# EAGLE design untitled (EAGLE 9.6.2)
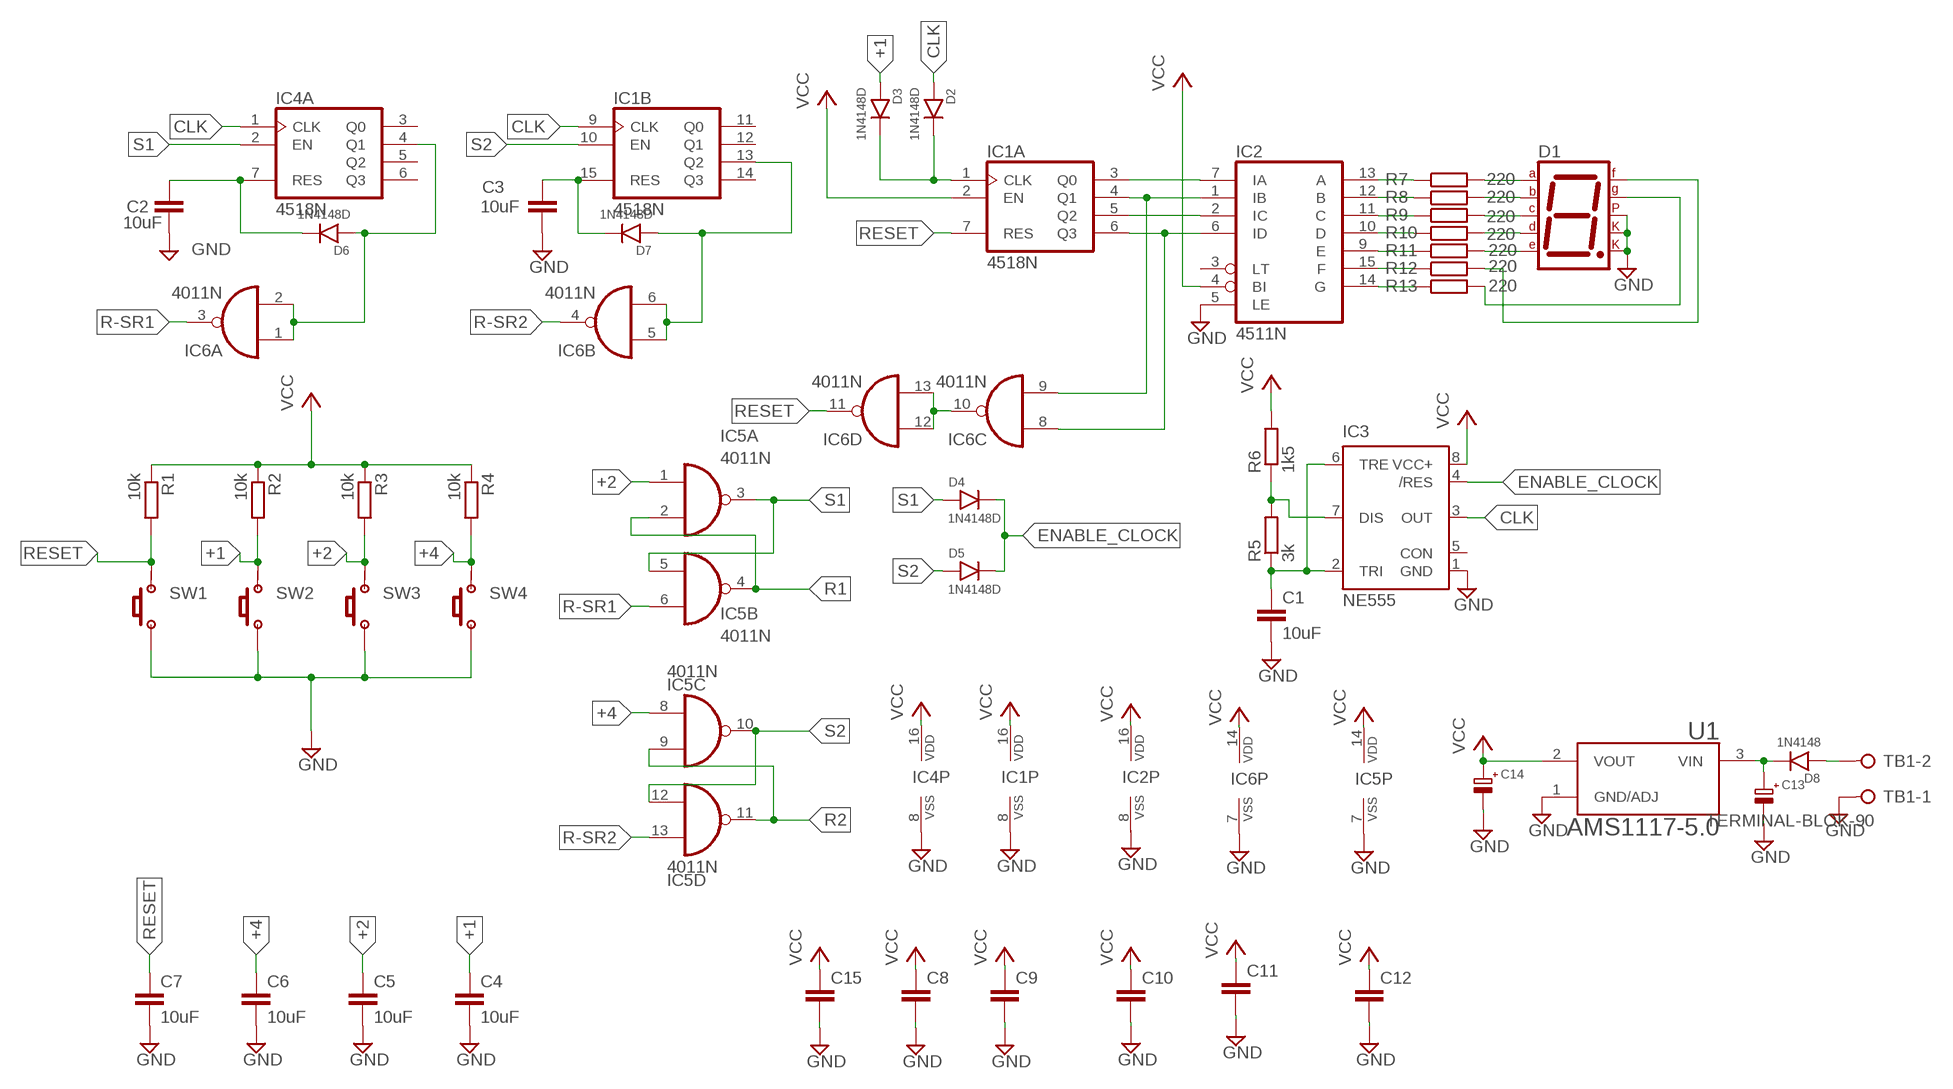
[diagram p0: schematic, sheet 1]

## Parts
C1  10uF  CAP-NON0805  [SMD0805]
C2  10uF  CAP-NON0805  [SMD0805]
C3  10uF  CAP-NON0805  [SMD0805]
C4  10uF  CAP-NON0805  [SMD0805]
C5  10uF  CAP-NON0805  [SMD0805]
C6  10uF  CAP-NON0805  [SMD0805]
C7  10uF  CAP-NON0805  [SMD0805]
C8  CAP-NON  [MKM]
C9  CAP-NON  [MKM]
C10  CAP-NON  [MKM]
C11  CAP-NON  [MKM]
C12  CAP-NON  [MKM]
C13  CAP-ELCO  [ELCO1]
C14  CAP-ELCO  [ELCO1]
C15  CAP-NON  [MKM]
D1  7SEG-CK  [7SEG-13]
D2  1N4148D  [SOD80C]
D3  1N4148D  [SOD80C]
D4  1N4148D  [SOD80C]
D5  1N4148D  [SOD80C]
D6  1N4148D  [SOD80C]
D7  1N4148D  [SOD80C]
D8  1N4148  [DIODE]
IC1  4518N  [DIL16]
IC2  4511N  [DIL16]
IC3  NE555  [DIL-08]
IC4  4518N  [DIL16]
IC5  4011N  [DIL14]
IC6  4011N  [DIL14]
R1  10k  RES0805  [SMD0805]
R2  10k  RES0805  [SMD0805]
R3  10k  RES0805  [SMD0805]
R4  10k  RES0805  [SMD0805]
R5  3k  RES0805  [SMD0805]
R6  1k5  RES0805  [SMD0805]
R7  220  RES0805  [SMD0805]
R8  220  RES0805  [SMD0805]
R9  220  RES0805  [SMD0805]
R10  220  RES0805  [SMD0805]
R11  220  RES0805  [SMD0805]
R12  220  RES0805  [SMD0805]
R13  220  RES0805  [SMD0805]
SW1  PUSH_BUTTON4P  [PUSH_BUTTON_4P]
SW2  PUSH_BUTTON4P  [PUSH_BUTTON_4P]
SW3  PUSH_BUTTON4P  [PUSH_BUTTON_4P]
SW4  PUSH_BUTTON4P  [PUSH_BUTTON_4P]
TB1  TERMINAL-BLOK-90  [MSTBA2]
U1  AMS1117-5.0  [SOT229P700X180-4N]

## Nets
+1: C4.1 D3.A R2.2 SW2.3 SW2.4
+2: C5.1 IC5.1(A:I0) R3.2 SW3.3 SW3.4
+4: C6.1 IC5.8(C:I0) R4.2 SW4.3 SW4.4
CLK: D2.A IC1.9(B:CLK) IC3.3(OUT) IC4.1(A:CLK)
ENABLE_CLOCK: D4.C D5.C IC3.4(/RES)
GND: C1.2 C2.2 C3.2 C4.2 C5.2 C6.2 C7.2 C8.2 C9.2 C10.2 C11.2 C12.2 C13.2 C14.2 C15.2 D1.3(CK1) D1.5(DP) D1.8(CK2) IC1.8(P:VSS) IC2.5(LE) IC3.1(GND) IC4.8(P:VSS) IC5.7(P:VSS) IC6.7(P:VSS) SW1.1 SW1.2 SW2.1 SW2.2 SW3.1 SW3.2 SW4.1 SW4.2 TB1.1 U1.1(GND/ADJ)
N$1: IC2.13(A) R7.1
N$2: D1.1(E) R11.2
N$3: D1.2(D) R10.2
N$4: D1.4(C) R9.2
N$5: D1.6(B) R8.2
N$6: D1.9(F) R12.2
N$7: D1.10(G) R13.2
N$8: IC1.6(A:Q3) IC2.6(ID) IC6.8(C:I0)
N$9: IC1.5(A:Q2) IC2.2(IC)
N$10: IC1.4(A:Q1) IC2.1(IB) IC6.9(C:I1)
N$11: IC1.3(A:Q0) IC2.7(IA)
N$12: C1.1 IC3.2(TRI) IC3.6(TRE) R5.1
N$13: D2.C D3.C IC1.1(A:CLK)
N$14: IC3.7(DIS) R5.2 R6.1
N$15: C2.1 D6.C IC4.7(A:RES)
N$16: C3.1 D7.C IC1.15(B:RES)
N$17: D6.A IC4.4(A:Q1) IC6.1(A:I0) IC6.2(A:I1)
N$18: D7.A IC1.13(B:Q2) IC6.5(B:I0) IC6.6(B:I1)
N$19: IC6.10(C:O) IC6.12(D:I0) IC6.13(D:I1)
N$20: D1.7(A) R7.2
N$21: IC2.12(B) R8.1
N$22: IC2.11(C) R9.1
N$23: IC2.10(D) R10.1
N$24: IC2.9(E) R11.1
N$25: IC2.15(F) R12.1
N$26: IC2.14(G) R13.1
N$32: C13.1 D8.2 U1.3(VIN)
N$33: D8.1 TB1.2
R1: IC5.2(A:I1) IC5.4(B:O)
R2: IC5.9(C:I1) IC5.11(D:O)
R-SR1: IC5.6(B:I1) IC6.3(A:O)
R-SR2: IC5.13(D:I1) IC6.4(B:O)
RESET: C7.1 IC1.7(A:RES) IC6.11(D:O) R1.2 SW1.3 SW1.4
S1: D4.A IC4.2(A:EN) IC5.3(A:O) IC5.5(B:I0)
S2: D5.A IC1.10(B:EN) IC5.10(C:O) IC5.12(D:I0)
VCC: C8.1 C9.1 C10.1 C11.1 C12.1 C14.1 C15.1 IC1.2(A:EN) IC1.16(P:VDD) IC2.4(BI) IC2.16(VDD) IC3.8(VCC+) IC4.16(P:VDD) IC5.14(P:VDD) IC6.14(P:VDD) R1.1 R2.1 R3.1 R4.1 R6.2 U1.2(VOUT)
Unconnected: IC1.11(B:Q0) IC1.12(B:Q1) IC1.14(B:Q3) IC2.3(LT) IC3.5(CON) IC4.3(A:Q0) IC4.5(A:Q2) IC4.6(A:Q3) IC4.9(B:CLK) IC4.10(B:EN) IC4.11(B:Q0) IC4.12(B:Q1) IC4.13(B:Q2) IC4.14(B:Q3) IC4.15(B:RES)

## Power pins joined to a net without a drawn wire
VSS: IC2.8(VSS)

## Library data of the parts
C1-C12 C15 = LKS_NAS_2024_PHD_A2_Library:CAP-NON
C13 C14 = LKS_NAS_2024_PHD_A2_Library:CAP-ELCO
D1 = special:7SEG-CK: 7-segment DISPLAY single cathode, 13 mm
D2-D8 = LKS_NAS_2024_PHD_A2_Library:1N4148
IC1 IC4 = 45xx:4518: Dual BCD up COUNTER
IC2 = 45xx:4511: BCD to 7-segment LATCH/DECODER/DRIVER
IC3 = st-microelectronics:NE555: General purpose bipolar Timer; MF: Arrow Electronics; MPN: NE555N; OC_FARNELL: 1467742; OC_NEWARK: 89K1486
IC5 IC6 = 40xx:4011: Quad 2-input NAND
R1-R13 = LKS_NAS_2024_PHD_A2_Library:RES: RESISTOR, European symbol
SW1-SW4 = LKS_NAS_2024_PHD_A2_Library:PUSH_BUTTON
TB1 = LKS_NAS_2024_PHD_A2_Library:TERMINAL-BLOK
U1 = 00-2024-SelekdaWSA:AMS1117-5.0: Check availability <https://pricing.snapeda.com/parts/AMS1117-5.0/Advanced%20Monolithic%20Systems/view-part?ref=eda>

## Board
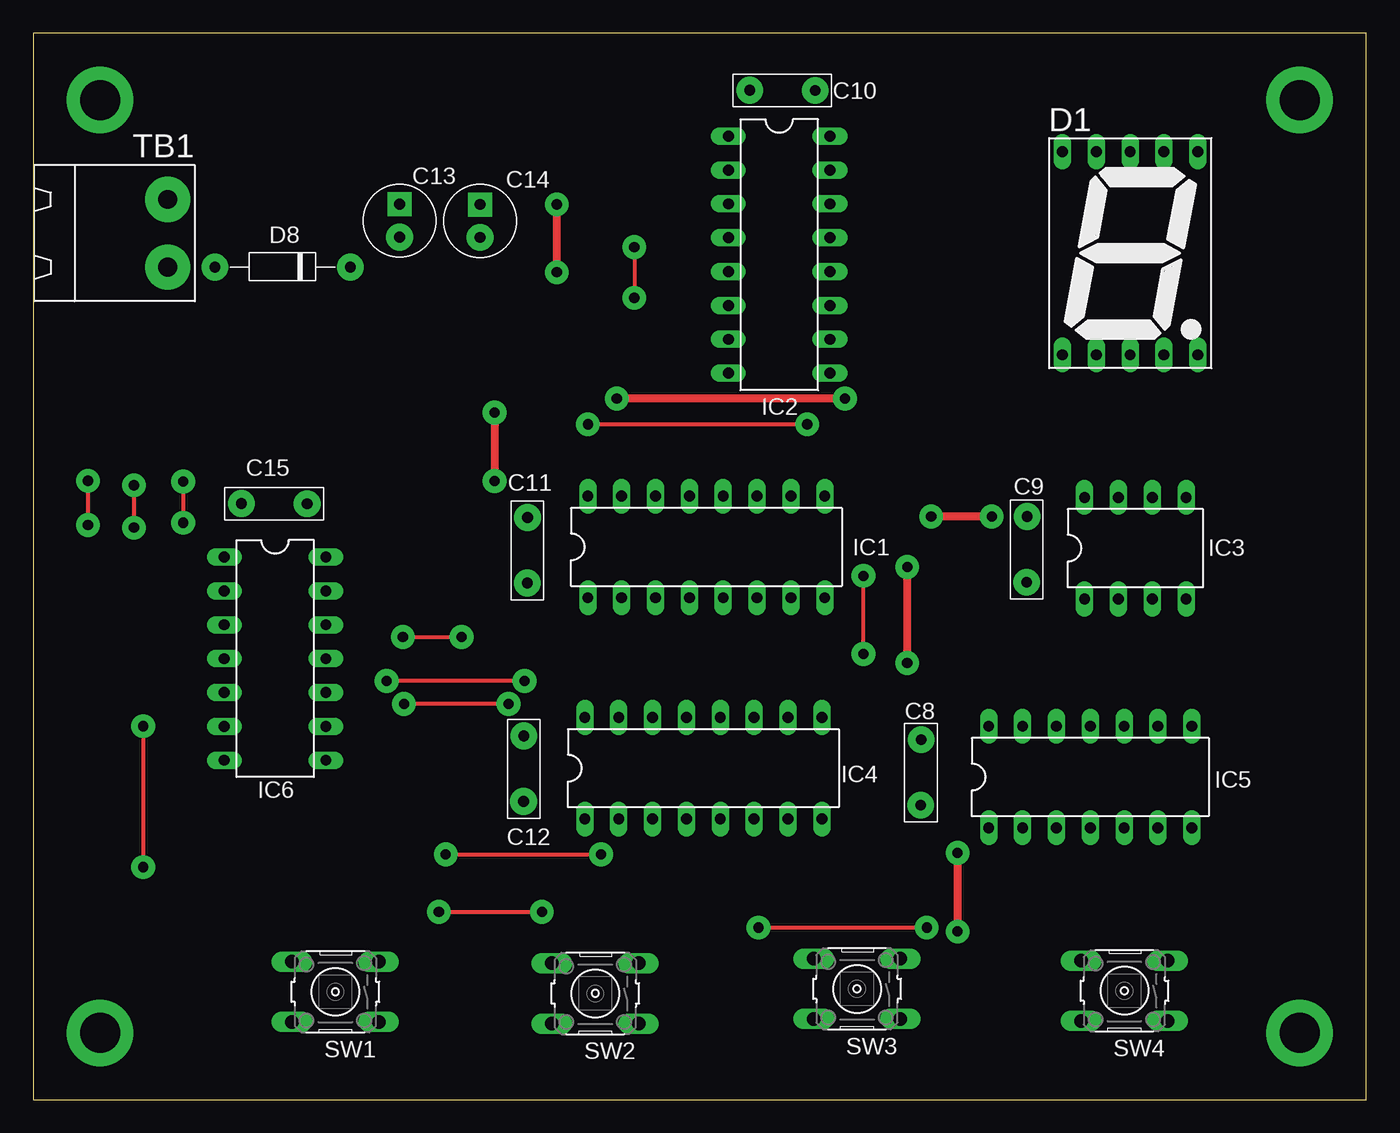
[diagram p1: board, top side]
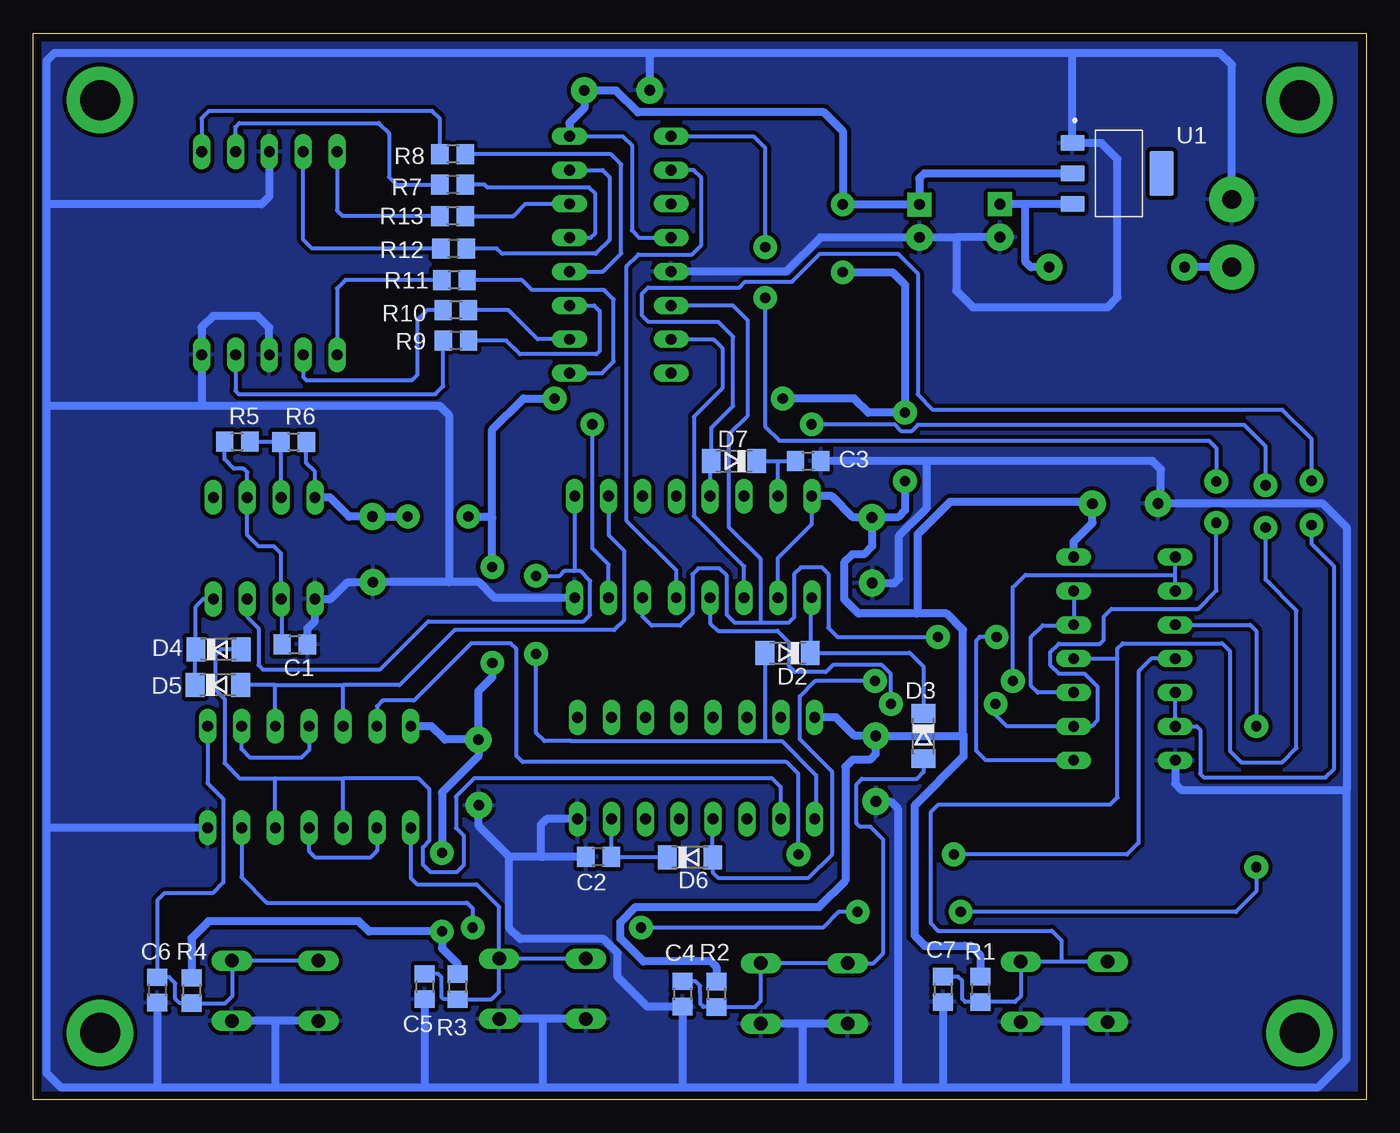
[diagram p2: board, bottom side, seen from below]

Size 100 x 80 mm. Coordinates in mm from the lower left corner, seen from the top.
Outline: 0,0 100,0 100,80 0,80 0,0
Copper layers (1*16): Top 0.035mm / dielectric 1.5mm / Bottom 0.035mm
Design rules "default": minimum track width 12mil, minimum drill 30mil, track to track 12mil, track to pad 12mil, pad to pad 12mil, via to via 6mil, smd to smd 6mil, copper to edge 24mil, drill to drill 6mil, minimum pad ring 10mil, minimum via ring 8mil, stop-mask expansion 4mil, vias tented up to drill 0mil, thermal gap 12mil

### Footprints (pad centres in the part's own frame; a part is rotated, then mirrored left to right if it is on the bottom)
SMD0805 = smd 1.3 x 1.5: 1 -0.95,0; 2 0.95,0
MKM = drill 0.8 pad 2: 1 -2.282,-0.019; 2 2.637,-0.047
ELCO1 = drill 0.8 pad 1.8 square: 1 -1.24,0 | drill 0.8 pad 2: 2 1.24,0
7SEG-13 = drill 0.813 long: 1 -5.08,-7.62; 2 -2.54,-7.62; 3 0,-7.62; 4 2.54,-7.62; 5 5.08,-7.62; 6 5.08,7.62; 7 2.54,7.62; 8 0,7.62; 9 -2.54,7.62; 10 -5.08,7.62
SOD80C = smd 1.4 x 1.8: A 1.7,0; C -1.7,0
DIODE = drill 0.8 pad 2: 1 -5.064,0.004; 2 5.096,0.004
DIL16 = drill 0.813 long: 1 -8.89,-3.81; 2 -6.35,-3.81; 3 -3.81,-3.81; 4 -1.27,-3.81; 5 1.27,-3.81; 6 3.81,-3.81; 7 6.35,-3.81; 8 8.89,-3.81; 9 8.89,3.81; 10 6.35,3.81; 11 3.81,3.81; 12 1.27,3.81; 13 -1.27,3.81; 14 -3.81,3.81; 15 -6.35,3.81; 16 -8.89,3.81
DIL-08 = drill 0.813 long: 1 -3.81,-3.81; 2 -1.27,-3.81; 3 1.27,-3.81; 4 3.81,-3.81; 5 3.81,3.81; 6 1.27,3.81; 7 -1.27,3.81; 8 -3.81,3.81
DIL14 = drill 0.813 long: 1 -7.62,-3.81; 2 -5.08,-3.81; 3 -2.54,-3.81; 4 0,-3.81; 5 2.54,-3.81; 6 5.08,-3.81; 7 7.62,-3.81; 8 7.62,3.81; 9 5.08,3.81; 10 2.54,3.81; 11 0,3.81; 12 -2.54,3.81; 13 -5.08,3.81; 14 -7.62,3.81
PUSH_BUTTON_4P = drill 1.016 long: 1 -3.251,2.261; 2 3.251,2.261; 3 -3.251,-2.261; 4 3.251,-2.261
MSTBA2 = drill 1.4 pad 3.4: 1 -2.54,5.08; 2 2.54,5.08
SOT229P700X180-4N = smd 1.2 x 1.8: 1 -2.29,-3.472; 2 0,-3.472; 3 2.29,-3.472 | smd 3.4 x 1.8: 4 0,3.218

### Placement (x,y rotation side)
C1  80.38,34.15 0 bottom
C2  57.6,18.2 180 bottom
C3  41.87,47.92 0 bottom
C4  51.3,7.92 270 bottom
C5  70.63,8.48 270 bottom
C6  90.7,8.22 270 bottom
C7  31.76,8.27 270 bottom
C8  66.63,24.72 270 top
C9  74.57,41.46 270 top
C10  56.38,75.69 180 top
C11  37.1,41.39 270 top
C12  36.83,25 270 top
C13  27.48,65.94 270 top
C14  33.52,65.92 270 top
C15  18.26,44.67 180 top
D1  82.29,63.5 0 top
D2  43.41,33.52 180 bottom
D3  33.21,27.27 270 bottom
D4  86.11,33.78 0 bottom
D5  86.15,31.09 0 bottom
D6  50.73,18.18 0 bottom
D7  47.44,47.89 180 bottom
D8  18.68,62.45 0 top
IC1  50.49,41.46 0 top
IC2  55.96,63.39 270 top
IC3  82.68,41.37 0 top
IC4  50.27,24.86 0 top
IC5  79.3,24.2 0 top
IC6  18.14,33.08 270 top
R1  28.95,8.27 270 bottom
R2  48.76,7.9 270 bottom
R3  68.17,8.47 270 bottom
R4  88.13,8.18 270 bottom
R5  84.7,49.37 0 bottom
R6  80.47,49.35 0 bottom
R7  68.54,68.65 180 bottom
R8  68.54,70.93 180 bottom
R9  68.3,56.95 180 bottom
R10  68.31,59.23 180 bottom
R11  68.41,61.49 180 bottom
R12  68.47,63.86 180 bottom
R13  68.54,66.29 180 bottom
SW1  22.66,8.08 180 top
SW2  42.16,7.96 180 top
SW3  61.8,8.3 180 top
SW4  81.86,8.16 180 top
TB1  5,65 270 top
U1  18.56,69.48 270 bottom

### Tracks (layer width: path | path; a pad name or v marks a point on that pad's centre or on a via)
+1
  Bottom 0.305: C4.1 50.32,8.87 49.97,8.52 49.97,8.01 49.96,8 49.96,7.19 49.72,6.95 R2.2 45.85,6.95 45.41,7.39 SW2.3 SW2.4 36.97,10.22 36.22,10.97 36.22,19.5 37.18,20.46 37.98,20.46 38.24,20.72 38.24,23.66 37.84,24.06 33.72,24.06 33.21,24.57 D3.A
+2
  Bottom 0.305: C5.1 69.65,9.43 69.38,9.16 69.38,7.69 69.2,7.52 R3.2 65.63,7.52 65.05,8.1 SW3.3 | SW3.4 SW3.3 | IC5.1 71.68,16.62 71.22,16.16 66.76,16.16 65.05,14.45 SW3.3
+4
  Bottom 0.305: IC5.8 86.92,23.72 85.75,22.55 85.75,16.29 86.56,15.48 90.17,15.48 90.7,14.95 C6.1 89.8,9.17 89.34,8.71 89.34,7.56 89.01,7.23 R4.2 85.62,7.23 85.06,7.79 85.06,10.42 | SW4.4 85.06,10.42 | 85.06,10.42 SW4.3
CLK  (via drill 0.76 pad 1.78)
  Top 0.305: v62.28,33.43 v62.28,39.29
  Bottom 0.305: IC3.3 83.95,36.21 83.1,35.36 83.1,32.59 82.79,32.28 73.97,32.28 70.38,35.87 58.72,35.87 58.22,36.38 58.22,38.91 58.94,39.64 59.4,39.64 | v62.28,33.43 62.28,27.52 61.66,26.9 59.63,26.9 59.62,26.89 45.11,26.89 | IC4.1 41.26,21.17 41.26,24.33 43.82,26.89 45.11,26.89 | v62.28,39.29 62.24,39.25 60.57,39.25 60.18,39.64 59.4,39.64 | 59.4,39.64 59.38,39.66 IC1.9 | 45.11,26.89 D2.A
ENABLE_CLOCK
  Bottom 0.305: D5.C 87.85,33.74 D4.C 87.81,37 87.25,37.56 IC3.4
GND
  Bottom 0.61: TB1.1 10.08,77.63 10.97,78.52 22,78.52 | 22,78.52 53.5,78.52 | 53.5,78.52 98.42,78.52 99.02,77.92 99.02,67.28 | 99.02,67.28 99.02,52.05 | 99.02,52.05 99.02,20.4 | 99.02,20.4 99.02,1.99 97.96,0.93 90.8,0.93 | 90.8,0.93 81.87,0.93 | 81.87,0.93 70.45,0.93 | 70.45,0.93 61.75,0.93 | 61.75,0.93 51.36,0.93 | 51.36,0.93 42.12,0.93 | 42.12,0.93 35.14,0.93 | 35.14,0.93 31.7,0.93 | 31.7,0.93 22.57,0.93 | 22.57,0.93 3.6,0.93 1.46,3.07 1.46,23.25 | 15.39,44.72 3.25,44.72 1.46,42.93 1.46,23.25 | 15.39,44.72 C15.2 | IC6.7 14.33,23.69 13.89,23.25 1.46,23.25 | SW1.2 22.53,5.82 | 22.53,5.82 SW1.1 | 22.53,5.82 22.53,0.97 22.57,0.93 | C7.2 31.76,0.99 31.7,0.93 | SW2.2 42.3,5.7 | 42.3,5.7 SW2.1 | 42.3,5.7 42.3,1.11 42.12,0.93 | 51.36,0.93 51.3,0.99 C4.2 53.93,6.97 56.16,9.2 56.16,10.99 57.21,12.04 63.47,12.04 64.29,12.86 64.29,18.2 | SW3.2 61.78,6.04 | 61.78,6.04 SW3.1 | 61.78,6.04 61.78,0.96 61.75,0.93 | SW4.2 81.85,5.9 | 81.85,5.9 SW4.1 | 81.85,5.9 81.87,5.88 81.87,0.93 | C5.2 70.63,1.11 70.45,0.93 | C6.2 90.7,1.03 90.8,0.93 | IC5.7 99.02,20.4 | 87.37,52.05 99.02,52.05 | 87.37,52.05 D1.5 87.37,57.94 86.52,58.79 83.16,58.79 82.29,57.92 D1.3 | C10.2 53.74,78.28 53.5,78.52 | 99.02,67.28 98.92,67.18 82.87,67.18 82.29,67.76 D1.8 | 87.37,52.05 69.5,52.05 68.82,51.37 68.82,38.82 | 35.14,0.93 35.14,21.84 35.66,22.36 C12.2 | 15.39,44.72 15.39,47.28 16.03,47.92 32.96,47.92 | C8.2 66.58,20.55 64.29,18.26 64.29,18.2 | IC4.8 61.49,21.05 61.93,20.61 61.93,18.31 61.82,18.2 | C2.2 61.82,18.2 | C13.2 30.75,64.7 | 30.75,64.7 33.5,64.7 C14.2 40.96,64.68 43.52,62.12 IC2.5 | 30.75,64.7 30.75,60.69 29.51,59.45 19.4,59.45 18.66,60.19 18.66,70.57 19.86,71.77 U1.1 22.03,78.49 22,78.52
  Bottom 0.61: 32.96,47.92 C3.2 | C1.2 79.43,35.35 78.87,35.91 IC3.1 77.68,37.56 76.42,38.82 C9.2 68.82,38.82 | IC1.8 65.4,37.65 66.57,38.82 68.82,38.82 | 61.82,18.2 64.29,18.2 | C11.2 35.39,38.75 35.05,39.09 35.05,42.31 32.96,44.4 32.96,47.92
  pour Bottom: 0,80 100,80 100,0 0,0
N$1
  Bottom 0.305: IC2.13 58.19,64.66 57.83,65.02 57.83,67.96 58.29,68.42 65.92,68.42 66.15,68.65 R7.1
N$2
  Bottom 0.305: R11.2 76.57,61.49 77.21,60.85 D1.1
N$3
  Bottom 0.305: R10.2 70.46,59.23 71.2,58.49 71.2,54.37 71.62,53.95 79.5,53.95 79.75,54.2 D1.2
N$4
  Bottom 0.305: D1.4 84.83,53.17 84.59,52.93 69.84,52.93 69.25,53.52 R9.2
N$5
  Bottom 0.305: R8.2 69.49,73.58 70.07,74.16 86.83,74.16 87.37,73.62 D1.6
N$6
  Bottom 0.305: R12.2 79.1,63.86 79.75,64.51 D1.9
N$7
  Bottom 0.305: D1.10 77.21,66.71 76.79,66.29 R13.2
N$8  (via drill 0.76 pad 1.78)
  Top 0.305: v27.73,34.71 v32.13,34.71
  Bottom 0.305: IC1.6 54.3,36.25 53.61,35.56 51.47,35.56 50.56,36.47 50.56,39.4 50.1,39.86 48.52,39.86 47.97,39.31 47.97,36.37 47.37,35.77 45.5,35.77 | IC2.6 47.52,59.58 46.4,58.46 46.4,51.32 47.8,49.92 47.8,42.92 45.46,40.58 45.46,35.81 45.5,35.77 | IC6.8 28.55,25.46 29.28,26.19 29.28,34.42 28.99,34.71 v27.73,34.71 | 45.5,35.77 43.34,35.77 42.92,36.18 42.92,39.43 42.42,39.93 40.84,39.93 40.35,39.44 40.35,35.39 39.67,34.71 v32.13,34.71
N$9
  Bottom 0.305: IC1.5 51.76,39.7 55.48,43.42 55.48,62.53 54.6,63.41 50.59,63.41 49.89,64.11 49.89,69.16 50.47,69.74 IC2.2
N$10  (via drill 0.76 pad 1.78)
  Top 0.305: v45.09,63.96 v45.09,60.15 | v11.24,46.37 v11.24,43.28 | v35.66,29.68 v27.81,29.68
  Bottom 0.305: IC2.1 45.97,72.28 45.09,71.4 v45.09,63.96 | v45.09,60.15 45.09,50.51 44.02,49.44 11.8,49.44 11.24,48.88 v11.24,46.37 | IC1.4 49.22,35.73 48.65,35.16 44.17,35.16 43.32,34.31 43.32,32.54 42.86,32.08 40.54,32.08 40.02,32.6 36.34,32.6 35.66,31.92 v35.66,29.68 | v27.81,29.68 27.81,28.84 26.97,28 IC6.9 20.6,28 20.17,28.43 20.17,31 21.13,31.96 23.07,31.96 23.73,32.62 23.73,33.54 23.07,34.2 19.98,34.2 19.69,34.49 19.69,36.24 19.11,36.82 12.6,36.82 11.24,38.18 v11.24,43.28
N$11
  Bottom 0.305: IC2.7 48.97,57.04 48.31,56.38 48.31,53.37 50.45,51.23 50.45,43.77 46.68,40 IC1.3
N$12
  Bottom 0.305: R5.1 85.65,48.04 84.95,47.34 84.22,47.34 83.95,47.07 IC3.6 83.95,42.34 83.11,41.5 81.94,41.5 81.41,40.97 IC3.2 81.33,37.48 C1.1
N$13
  Bottom 0.305: IC1.1 41.71,37.54 D2.C 34.25,33.52 33.21,32.48 D3.C
N$14
  Bottom 0.305: R5.2 83.73,49.35 R6.1 IC3.7
N$15
  Bottom 0.305: D6.C 56.63,18.18 C2.1 56.62,18.23 IC4.7
N$16
  Bottom 0.305: D7.C 44.14,47.89 | IC1.15 44.14,47.89 | 44.14,47.89 42.85,47.89 C3.1
N$17  (via drill 0.76 pad 1.78)
  Top 0.305: v36.85,31.41 v26.51,31.41
  Bottom 0.305: IC6.2 14.33,39.47 | 14.33,39.47 IC6.1 | IC4.4 49.03,21.02 D6.A 49.03,17.04 48.63,16.64 41.83,16.64 40.06,18.41 40.06,24.59 42.5,27.03 42.5,30.25 41.34,31.41 v36.85,31.41 | v26.51,31.41 26.51,38.42 25.56,39.37 14.43,39.37 14.33,39.47
N$18  (via drill 0.76 pad 1.78)
  Top 0.305: v4.1,43.1 v4.1,46.42
  Bottom 0.305: IC6.5 IC6.6 12.71,28 12.46,27.75 12.46,24.45 12.17,24.16 3.06,24.16 2.41,24.81 2.41,40 4.1,41.69 v4.1,43.1 | IC1.13 49.22,47.81 D7.A 49.14,50.4 47.5,52.04 47.5,57.24 48.6,58.34 53.86,58.34 54.33,58.81 54.33,60.47 53.88,60.92 47.03,60.92 46.59,61.36 43.07,61.36 40.98,63.45 35.12,63.45 33.64,61.97 33.64,52.9 32.49,51.75 6.28,51.75 4.1,49.57 v4.1,46.42
N$19
  Bottom 0.305: IC6.13 21.95,35.72 IC6.12 21.95,35.58 24.26,35.58 25.15,34.69 25.15,31.05 24.64,30.54 IC6.10
N$20
  Bottom 0.305: R7.2 72.75,68.65 73.32,69.22 73.32,72.49 74.09,73.26 84.54,73.26 84.83,72.97 D1.7
N$21
  Bottom 0.305: IC2.12 57.26,62.12 55.9,63.48 55.9,70.18 56.65,70.93 R8.1
N$22
  Bottom 0.305: IC2.11 57.92,59.58 57.51,59.17 57.51,56.16 57.75,55.92 63.49,55.92 64.52,56.95 R9.1
N$23
  Bottom 0.305: IC2.10 62.16,57.04 64.34,59.23 R10.1
N$24
  Bottom 0.305: IC2.9 57.33,54.5 56.46,55.37 56.46,60.03 57.17,60.74 62.6,60.74 63.35,61.49 R11.1
N$25
  Bottom 0.305: IC2.15 57.29,69.74 56.77,69.22 56.77,64.49 57.81,63.45 64.83,63.45 65.24,63.86 R12.1
N$26
  Bottom 0.305: R13.1 63.97,66.29 63.06,67.2 IC2.14
N$27  (via drill 3 pad 5)
  other vias: 5,75
N$28  (via drill 3 pad 5)
  other vias: 5,5
N$29  (via drill 3 pad 5)
  other vias: 95,5
N$30  (via drill 3 pad 5)
  other vias: 95,75
N$32
  Bottom 0.61: U1.3 25.55,67.19 25.56,67.18 | 25.56,67.18 C13.1 | D8.2 25.15,62.45 25.56,62.86 25.56,67.18
N$33
  Bottom 0.61: TB1.2 D8.1
R1
  Bottom 0.305: IC5.2 74.22,18.66 74.74,18.14 78.81,18.14 79.3,18.63 IC5.4
R2
  Bottom 0.305: IC5.11 79.3,26.25 79.9,25.65 83.74,25.65 84.38,26.29 IC5.9
R-SR1  (via drill 0.76 pad 1.78)
  Top 0.305: v67.03,12.9 v54.41,12.9 | v8.25,28.01 v8.25,17.44 | v30.43,14.08 v38.16,14.08
  Bottom 0.305: IC5.6 84.38,16.67 82.48,14.77 67.47,14.77 67.03,14.34 v67.03,12.9 | IC6.3 8.71,35.62 8.25,35.16 v8.25,28.01 | v8.25,17.44 8.25,15.61 9.78,14.08 v30.43,14.08 | v38.16,14.08 39.58,14.08 40.76,12.9 v54.41,12.9
R-SR2  (via drill 0.76 pad 1.78)
  Top 0.305: v30.94,18.39 v42.6,18.39
  Bottom 0.305: IC6.4 16.12,33.08 17.09,32.11 17.09,19.24 17.94,18.39 v30.94,18.39 | v42.6,18.39 42.6,24.44 43.48,25.32 63.28,25.32 63.76,25.8 63.76,33.8 64.19,34.23 67.15,34.23 71.44,29.94 73.79,29.94 74.22,29.51 IC5.13
RESET  (via drill 0.76 pad 1.78)
  Top 0.305: v58.06,50.66 v41.61,50.66 | v7.55,42.91 v7.55,46.09
  Bottom 0.305: C7.1 30.63,9.22 30.31,8.9 30.31,7.55 30.08,7.32 R1.2 26.34,7.32 25.91,7.75 SW1.3 22.85,10.34 | SW1.4 22.85,10.34 | IC1.7 56.84,40.14 58.06,41.36 v58.06,50.66 | v41.61,50.66 35.41,50.66 34.87,50.12 34.13,50.12 33.64,50.61 9.16,50.61 7.55,49 v7.55,46.09 | 18.66,33.09 18.66,33.84 18.27,34.23 10.8,34.23 10.21,33.65 10.21,26.16 9.36,25.31 6.3,25.31 5.24,26.37 5.24,36.69 7.55,39 v7.55,42.91 | 18.66,33.09 18.67,33.08 IC6.11 | 18.66,33.09 18.66,22.66 19.2,22.13 32.1,22.13 32.69,21.54 32.69,13.24 32.13,12.68 23.6,12.68 22.85,11.93 22.85,10.34
S1
  Bottom 0.305: 81.84,24.1 84.52,24.1 85.66,25.24 85.66,30.07 86.36,30.77 86.36,33.33 85.91,33.78 D4.A | 81.84,24.1 76.75,24.1 | IC5.5 81.84,24.1 | IC4.2 43.92,23.42 44.6,24.1 66.93,24.1 68.29,22.74 68.29,20.38 67.71,19.8 67.71,17.58 68.25,17.05 70.21,17.05 70.77,17.61 70.77,18.94 70.28,19.43 70.28,23.28 71.1,24.1 76.75,24.1 | 76.75,24.1 76.76,24.09 IC5.3
S2
  Bottom 0.305: 81.84,31.09 D5.A | IC5.10 81.84,31.09 | 81.84,31.09 76.74,31.09 | IC1.10 56.84,42.35 55.69,41.2 55.69,35.96 56.42,35.23 68.38,35.23 72.52,31.09 76.74,31.09 | 76.74,31.09 76.76,31.07 IC5.12
VCC  (via drill 0.76 pad 1.78)
  Top 0.61: v39.27,67.16 v39.27,62.07 | v34.6,51.54 v34.6,46.4 | v69.34,18.5 v69.34,12.61 | v65.57,39.95 v65.56,39.94 v65.56,32.75 | v71.91,43.74 v67.36,43.74 | v60.89,52.6 v43.77,52.6
  Bottom 0.305: IC2.4 54.54,64.66 55.1,65.22 55.1,71.59 55.79,72.28 IC2.16 | IC1.16 41.6,43.17 44.14,40.63 IC1.2 | IC3.8 78.87,47.11 79.52,47.76 R6.2
  Bottom 0.61: U1.2 33.16,69.48 33.52,69.12 C14.1 v39.27,67.16 39.27,72.67 40.68,74.08 54.64,74.08 56.27,75.71 C10.1 58.66,74.4 59.77,73.29 IC2.16 | IC6.14 21.95,41.86 20.54,43.27 C15.1 20.69,44.84 31.22,44.84 33.65,42.41 33.65,36.53 33.72,36.46 | C11.1 38.49,43.67 40.09,45.27 IC1.16 | IC3.8 77.75,45.18 76.31,43.74 C9.1 v71.91,43.74 | C8.1 69.11,27 70.12,28.01 IC5.14 | v39.27,62.07 35.53,62.07 34.6,61.14 v34.6,51.54 37.36,51.54 38.42,52.6 v43.77,52.6 | C11.1 35.15,43.67 34.6,44.22 v34.6,46.4 | C11.1 37.08,41.52 37.69,40.91 38.55,40.91 39.17,40.29 39.17,37.55 38.08,36.46 33.72,36.46 | 30.25,27.28 30.21,27.32 30.21,25.73 33.89,22.05 33.89,12.31 33.11,11.53 30.14,11.53 30.12,11.55 29.67,11.55 28.95,10.83 R1.1 | C12.1 30.25,27.28 | C8.1 66.61,30.65 65.56,31.7 v65.56,32.75 | C12.1 38.38,27.28 39.77,28.67 IC4.16 | R4.1 88.13,12.1 86.85,13.38 75.59,13.38 74.82,12.61 v69.34,12.61 69.34,11.36 68.17,10.19 R3.1 | C8.1 66.61,25.76 69.34,23.03 v69.34,18.5 | C12.1 36.81,25.93 37.25,25.49 38.54,25.49 39.07,24.96 39.07,16.41 41.04,14.44 54.83,14.44 55.96,13.3 55.96,12.09 54.23,10.36 49.17,10.36 48.76,9.95 R2.1 | v60.89,52.6 63.23,52.6 65.57,50.26 65.57,43.66 | v65.57,39.95 65.57,43.66 | v67.36,43.74 65.65,43.74 65.57,43.66 | 33.72,36.46 31.47,36.46 30.25,35.24 30.25,27.28